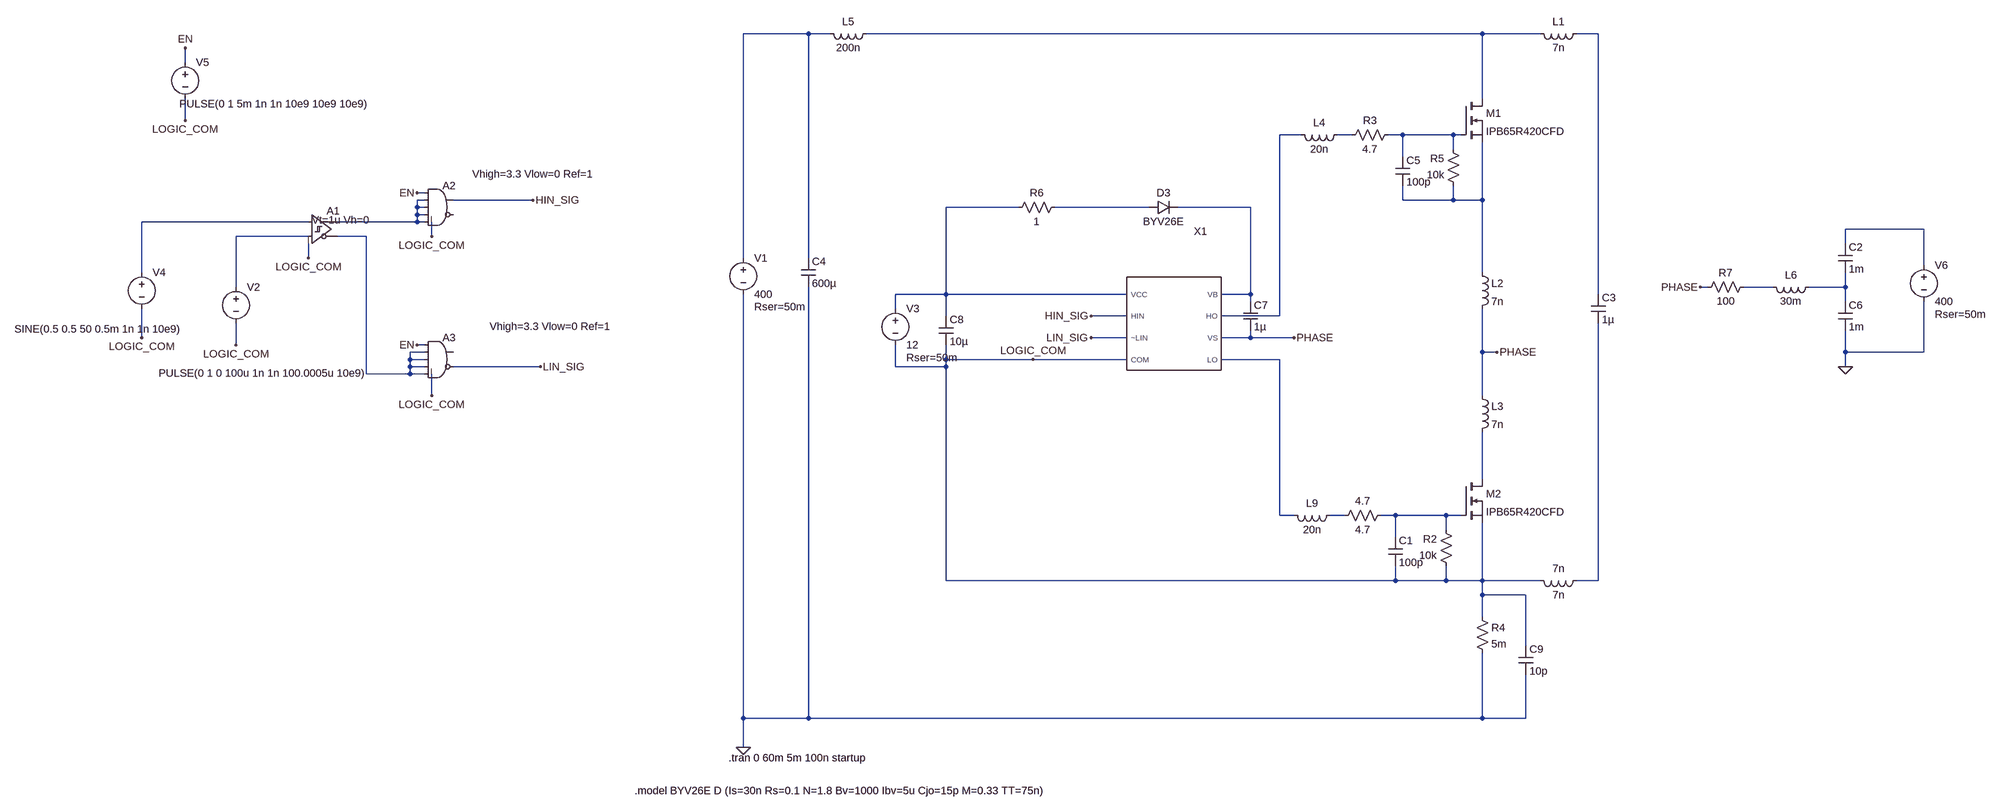
[diagram p0: schematic leg_inverter0.asc]
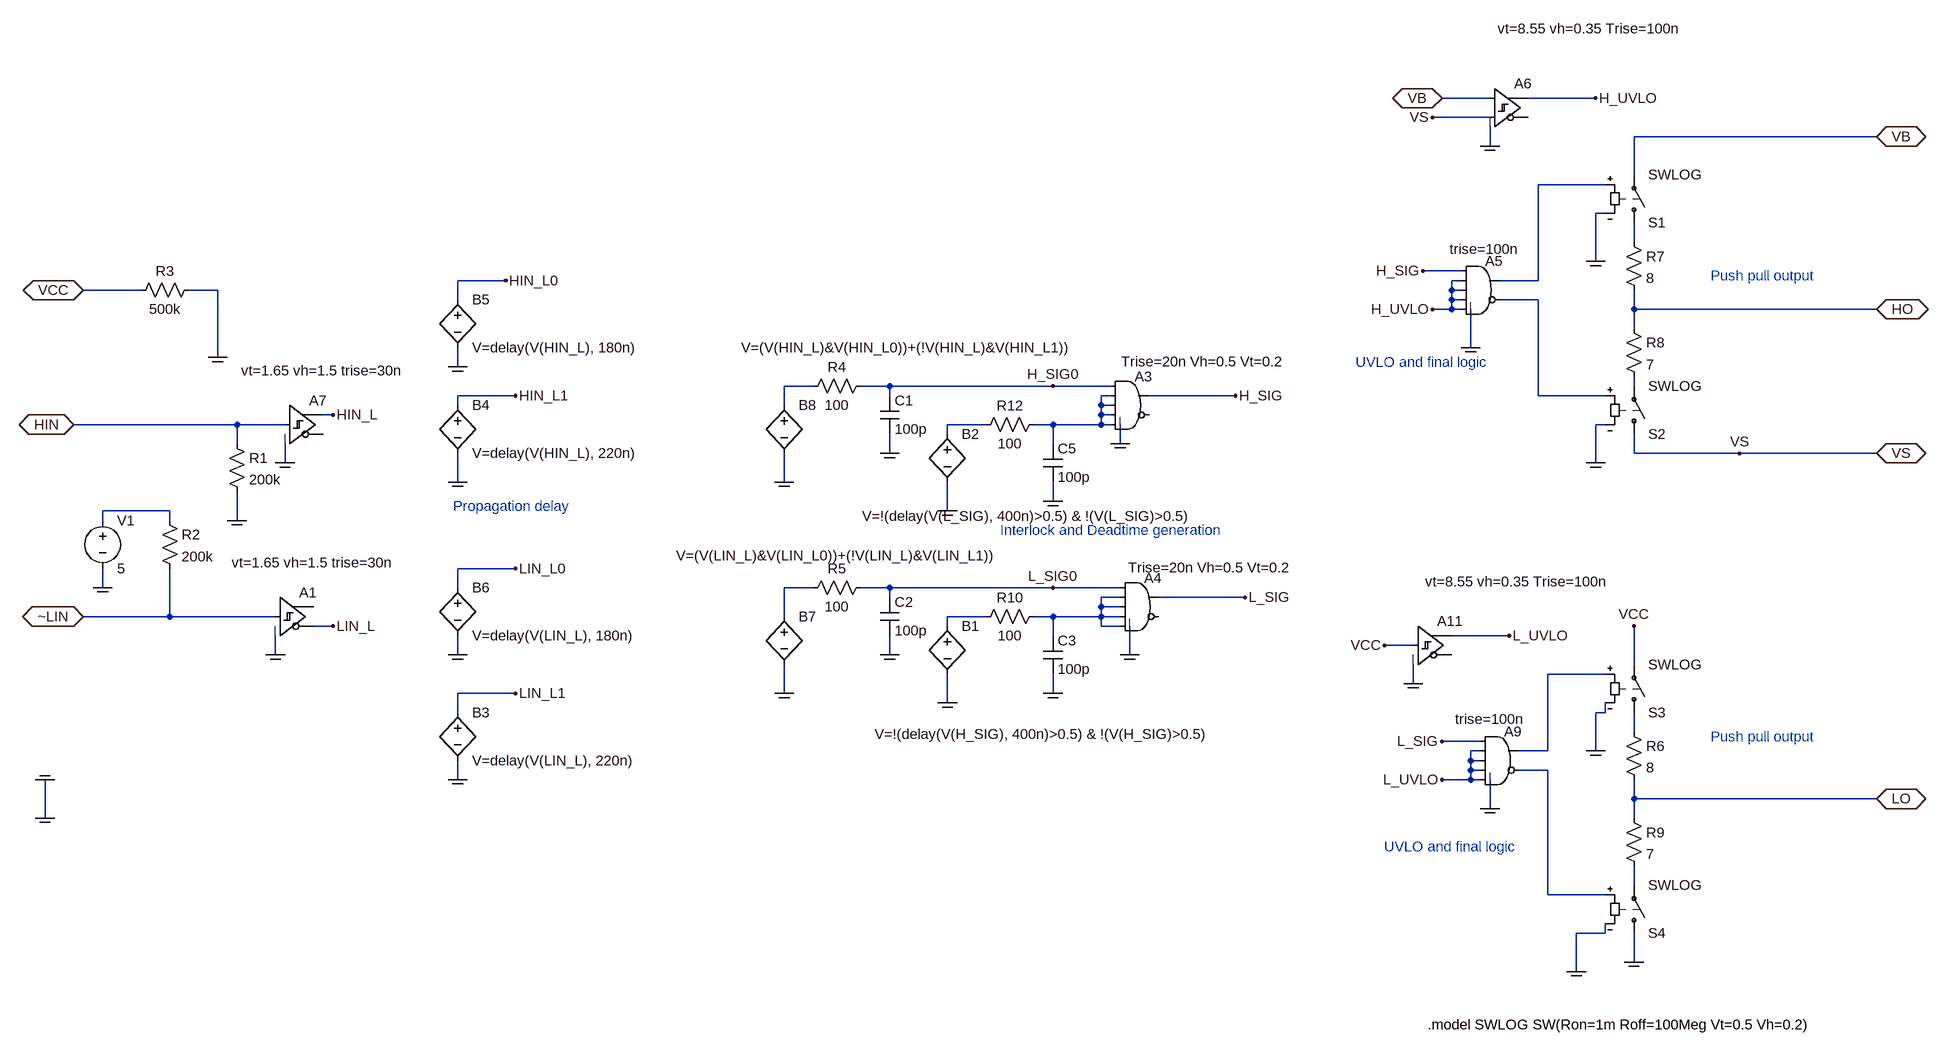
[diagram p1: sub-circuit ir2183_behavioral.asc]
leg_inverter0.asc, the LTspice schematic file:
Version 4.1
SHEET 1 1704 1644
WIRE -1152 -432 -1296 -432
WIRE -1104 -432 -1152 -432
WIRE 336 -432 -1024 -432
WIRE 464 -432 336 -432
WIRE 592 -432 544 -432
WIRE -2528 -368 -2528 -400
WIRE 336 -288 336 -432
WIRE -2528 -240 -2528 -288
WIRE -64 -208 -112 -208
WIRE 48 -208 16 -208
WIRE 160 -208 128 -208
WIRE 272 -208 160 -208
WIRE 288 -208 272 -208
WIRE 272 -176 272 -208
WIRE 160 -160 160 -208
WIRE -2000 -80 -2016 -80
WIRE -2000 -64 -2016 -64
WIRE -1760 -64 -1936 -64
WIRE 160 -64 160 -96
WIRE 272 -64 272 -96
WIRE 272 -64 160 -64
WIRE 336 -64 336 -192
WIRE 336 -64 272 -64
WIRE -2016 -48 -2016 -64
WIRE -2000 -48 -2016 -48
WIRE -688 -48 -848 -48
WIRE -400 -48 -608 -48
WIRE -176 -48 -336 -48
WIRE -2016 -32 -2016 -48
WIRE -2000 -32 -2016 -32
WIRE -2256 -16 -2624 -16
WIRE -2016 -16 -2016 -32
WIRE -2016 -16 -2192 -16
WIRE -2000 -16 -2016 -16
WIRE 1424 0 1184 0
WIRE -2256 16 -2416 16
WIRE -2128 16 -2192 16
WIRE -1984 16 -1984 -16
WIRE 1184 32 1184 0
WIRE -2256 64 -2256 32
WIRE -1296 64 -1296 -432
WIRE -1152 64 -1152 -432
WIRE 1424 80 1424 0
WIRE -2624 96 -2624 -16
WIRE 336 96 336 -64
WIRE -2416 128 -2416 16
WIRE 880 128 864 128
WIRE 1024 128 960 128
WIRE 1184 128 1184 96
WIRE 1184 128 1104 128
WIRE -848 144 -848 -48
WIRE -848 144 -960 144
WIRE -448 144 -848 144
WIRE -176 144 -176 -48
WIRE -176 144 -240 144
WIRE 592 144 592 -432
WIRE -176 160 -176 144
WIRE 1184 160 1184 128
WIRE -960 176 -960 144
WIRE -848 192 -848 144
WIRE -448 192 -528 192
WIRE -112 192 -112 -208
WIRE -112 192 -240 192
WIRE -2624 240 -2624 176
WIRE -448 240 -528 240
WIRE -176 240 -176 224
WIRE -176 240 -240 240
WIRE -80 240 -176 240
WIRE -2416 256 -2416 208
WIRE -2000 256 -2016 256
WIRE -2000 272 -2032 272
WIRE 336 272 336 176
WIRE 368 272 336 272
WIRE 1184 272 1184 224
WIRE 1424 272 1424 160
WIRE 1424 272 1184 272
WIRE -2032 288 -2032 272
WIRE -2000 288 -2032 288
WIRE -848 288 -848 256
WIRE -656 288 -848 288
WIRE -448 288 -656 288
WIRE -112 288 -240 288
WIRE -2032 304 -2032 288
WIRE -2000 304 -2032 304
WIRE -1744 304 -1936 304
WIRE -960 304 -960 256
WIRE -848 304 -848 288
WIRE -848 304 -960 304
WIRE 1184 304 1184 272
WIRE -2128 320 -2128 16
WIRE -2032 320 -2032 304
WIRE -2032 320 -2128 320
WIRE -2000 320 -2032 320
WIRE -1984 368 -1984 320
WIRE 336 368 336 272
WIRE 336 576 336 448
WIRE -112 656 -112 288
WIRE -80 656 -112 656
WIRE 32 656 0 656
WIRE 144 656 112 656
WIRE 256 656 144 656
WIRE 288 656 256 656
WIRE 256 688 256 656
WIRE 144 704 144 656
WIRE -848 800 -848 304
WIRE 144 800 144 768
WIRE 144 800 -848 800
WIRE 256 800 256 768
WIRE 256 800 144 800
WIRE 336 800 336 672
WIRE 336 800 256 800
WIRE 464 800 336 800
WIRE 592 800 592 208
WIRE 592 800 544 800
WIRE 336 832 336 800
WIRE 432 832 336 832
WIRE 336 880 336 832
WIRE 432 944 432 832
WIRE -1296 1104 -1296 144
WIRE -1152 1104 -1152 128
WIRE -1152 1104 -1296 1104
WIRE 336 1104 336 960
WIRE 336 1104 -1152 1104
WIRE 432 1104 432 1008
WIRE 432 1104 336 1104
WIRE -1296 1168 -1296 1104
FLAG 368 272 PHASE
FLAG -1296 1168 0
FLAG -80 240 PHASE
FLAG 1184 304 0
FLAG 864 128 PHASE
FLAG -1760 -64 HIN_SIG
FLAG -528 192 HIN_SIG
FLAG -1744 304 LIN_SIG
FLAG -2528 -400 EN
FLAG -2016 -80 EN
FLAG -2016 256 EN
FLAG -528 240 LIN_SIG
FLAG -656 288 LOGIC_COM
FLAG -1984 368 LOGIC_COM
FLAG -1984 16 LOGIC_COM
FLAG -2256 64 LOGIC_COM
FLAG -2416 256 LOGIC_COM
FLAG -2624 240 LOGIC_COM
FLAG -2528 -240 LOGIC_COM
SYMBOL res 128 640 R90
WINDOW 0 0 56 VBottom 2
WINDOW 3 32 56 VTop 2
SYMATTR InstName 4.7
SYMATTR Value 4.7
SYMBOL res 272 784 R180
WINDOW 0 36 76 Left 2
WINDOW 3 36 40 Left 2
SYMATTR InstName R2
SYMATTR Value 10k
SYMBOL cap 128 704 R0
SYMATTR InstName C1
SYMATTR Value 100p
SYMBOL cap -1168 64 R0
SYMATTR InstName C4
SYMATTR Value 600µ
SYMATTR SpiceLine Rser=1 Lser=20n
SYMBOL ind 560 -448 R90
WINDOW 0 5 56 VBottom 2
WINDOW 3 32 56 VTop 2
SYMATTR InstName L1
SYMATTR Value 7n
SYMBOL ind 560 784 R90
WINDOW 0 5 56 VBottom 2
WINDOW 3 32 56 VTop 2
SYMATTR InstName 7n
SYMATTR Value 7n
SYMBOL ind -1008 -448 R90
WINDOW 0 5 56 VBottom 2
WINDOW 3 32 56 VTop 2
SYMATTR InstName L5
SYMATTR Value 200n
SYMBOL voltage -1296 48 R0
WINDOW 123 0 0 Left 0
WINDOW 39 24 124 Left 2
SYMATTR SpiceLine Rser=50m
SYMATTR InstName V1
SYMATTR Value 400
SYMBOL diode -400 -32 R270
WINDOW 0 32 32 VTop 2
WINDOW 3 0 32 VBottom 2
SYMATTR InstName D3
SYMATTR Value BYV26E
SYMBOL cap -192 160 R0
SYMATTR InstName C7
SYMATTR Value 1µ
SYMBOL cap -864 192 R0
SYMATTR InstName C8
SYMATTR Value 10µ
SYMBOL voltage -960 160 R0
WINDOW 123 0 0 Left 0
WINDOW 39 24 124 Left 2
SYMATTR SpiceLine Rser=50m
SYMATTR InstName V3
SYMATTR Value 12
SYMBOL nmos 288 576 R0
SYMATTR InstName M2
SYMATTR Value IPB65R420CFD
SYMBOL IR2183_Behavioral -288 192 R0
SYMATTR InstName X1
SYMBOL nmos 288 -288 R0
SYMATTR InstName M1
SYMATTR Value IPB65R420CFD
SYMBOL res 144 -224 R90
WINDOW 0 0 56 VBottom 2
WINDOW 3 32 56 VTop 2
SYMATTR InstName R3
SYMATTR Value 4.7
SYMBOL res 288 -80 R180
WINDOW 0 36 76 Left 2
WINDOW 3 36 40 Left 2
SYMATTR InstName R5
SYMATTR Value 10k
SYMBOL cap 144 -160 R0
SYMATTR InstName C5
SYMATTR Value 100p
SYMBOL res -704 -32 R270
WINDOW 0 32 56 VTop 2
WINDOW 3 0 56 VBottom 2
SYMATTR InstName R6
SYMATTR Value 1
SYMBOL ind 320 80 R0
SYMATTR InstName L2
SYMATTR Value 7n
SYMBOL ind 320 352 R0
SYMATTR InstName L3
SYMATTR Value 7n
SYMBOL res 976 112 R90
WINDOW 0 0 56 VBottom 2
WINDOW 3 32 56 VTop 2
SYMATTR InstName R7
SYMATTR Value 100
SYMBOL ind 1120 112 R90
WINDOW 0 5 56 VBottom 2
WINDOW 3 32 56 VTop 2
SYMATTR InstName L6
SYMATTR Value 30m
SYMBOL ind 32 -224 R90
WINDOW 0 5 56 VBottom 2
WINDOW 3 32 56 VTop 2
SYMATTR InstName L4
SYMATTR Value 20n
SYMBOL ind 16 640 R90
WINDOW 0 5 56 VBottom 2
WINDOW 3 32 56 VTop 2
SYMATTR InstName L9
SYMATTR Value 20n
SYMBOL cap 576 144 R0
SYMATTR InstName C3
SYMATTR Value 1µ
SYMATTR SpiceLine Rser=10m Lser=7n
SYMBOL voltage -2416 112 R0
WINDOW 123 0 0 Left 0
WINDOW 39 0 0 Left 0
WINDOW 3 -171 206 Left 2
SYMATTR Value PULSE(0 1 0 100u 1n 1n 100.0005u 10e9)
SYMATTR InstName V2
SYMBOL voltage -2624 80 R0
WINDOW 123 0 0 Left 0
WINDOW 39 0 0 Left 0
WINDOW 3 -281 141 Left 2
SYMATTR Value SINE(0.5 0.5 50 0.5m 1n 1n 10e9)
SYMATTR InstName V4
SYMBOL Digital\\diffschmitt -2256 -64 R0
WINDOW 39 8 44 Left 2
SYMATTR SpiceLine Vt=1u Vh=0
SYMATTR InstName A1
SYMBOL Digital\\and -1968 -112 R0
WINDOW 39 74 -10 Left 2
SYMATTR SpiceLine Vhigh=3.3 Vlow=0 Ref=1
SYMATTR InstName A2
SYMBOL voltage -2528 -384 R0
WINDOW 123 0 0 Left 0
WINDOW 39 0 0 Left 0
WINDOW 3 -13 107 Left 2
SYMATTR Value PULSE(0 1 5m 1n 1n 10e9 10e9 10e9)
SYMATTR InstName V5
SYMBOL Digital\\and -1968 224 R0
WINDOW 39 112 -9 Left 2
SYMATTR SpiceLine Vhigh=3.3 Vlow=0 Ref=1
SYMATTR InstName A3
SYMBOL voltage 1424 64 R0
WINDOW 123 0 0 Left 0
WINDOW 39 24 124 Left 2
SYMATTR SpiceLine Rser=50m
SYMATTR InstName V6
SYMATTR Value 400
SYMBOL cap 1168 32 R0
SYMATTR InstName C2
SYMATTR Value 1m
SYMATTR SpiceLine V=650 Irms=1000 Rser=10m Lser=10n
SYMBOL cap 1168 160 R0
SYMATTR InstName C6
SYMATTR Value 1m
SYMATTR SpiceLine V=650 Irms=1000 Rser=10m Lser=10n
SYMBOL res 320 864 R0
SYMATTR InstName R4
SYMATTR Value 5m
SYMBOL cap 416 944 R0
SYMATTR InstName C9
SYMATTR Value 10p
TEXT -1328 1192 Left 2 !.tran 0 60m 5m 100n startup
TEXT -1536 1264 Left 2 !.model BYV26E D (Is=30n Rs=0.1 N=1.8 Bv=1000 Ibv=5u Cjo=15p M=0.33 TT=75n)

ir2183_behavioral.asc, the sub-circuit schematic file:
Version 4.1
SHEET 1 1824 1396
WIRE 432 -336 352 -336
WIRE 608 -336 496 -336
WIRE 432 -304 336 -304
WIRE 1168 -272 672 -272
WIRE 432 -256 432 -288
WIRE 672 -208 672 -272
WIRE 624 -192 512 -192
WIRE 624 -144 608 -144
WIRE 672 -96 672 -128
WIRE 608 -64 608 -144
WIRE 384 -48 320 -48
WIRE -1280 -32 -1360 -32
WIRE 384 -32 368 -32
WIRE 512 -32 512 -192
WIRE 512 -32 448 -32
WIRE -1888 -16 -1984 -16
WIRE -1760 -16 -1808 -16
WIRE 368 -16 368 -32
WIRE 384 -16 368 -16
WIRE -1360 0 -1360 -32
WIRE 368 0 368 -16
WIRE 384 0 368 0
WIRE 512 0 448 0
WIRE 368 16 368 0
WIRE 368 16 336 16
WIRE 384 16 368 16
WIRE 672 16 672 -16
WIRE 1168 16 672 16
WIRE 672 48 672 16
WIRE 400 80 400 16
WIRE -1760 96 -1760 -16
WIRE -1360 112 -1360 80
WIRE -768 144 -816 144
WIRE -640 144 -688 144
WIRE -368 144 -640 144
WIRE -272 144 -368 144
WIRE 672 144 672 128
WIRE -1264 160 -1360 160
WIRE -640 160 -640 144
WIRE -272 160 -288 160
WIRE -64 160 -208 160
WIRE 512 160 512 0
WIRE 624 160 512 160
WIRE -1360 176 -1360 160
WIRE -816 176 -816 144
WIRE -288 176 -288 160
WIRE -272 176 -288 176
WIRE -1568 192 -1584 192
WIRE -288 192 -288 176
WIRE -272 192 -288 192
WIRE -1728 208 -2000 208
WIRE -1648 208 -1728 208
WIRE -480 208 -544 208
WIRE -368 208 -400 208
WIRE -288 208 -288 192
WIRE -288 208 -368 208
WIRE -272 208 -288 208
WIRE 624 208 608 208
WIRE -544 224 -544 208
WIRE -1728 240 -1728 208
WIRE -368 240 -368 208
WIRE -256 240 -256 208
WIRE -640 256 -640 224
WIRE 672 256 672 224
WIRE 848 256 672 256
WIRE 1168 256 848 256
WIRE -1648 272 -1648 240
WIRE 608 272 608 208
WIRE -1360 304 -1360 256
WIRE -816 304 -816 256
WIRE -368 336 -368 304
WIRE -1840 352 -1952 352
WIRE -544 352 -544 304
WIRE -1952 368 -1952 352
WIRE -1840 368 -1840 352
WIRE -1728 368 -1728 320
WIRE -1264 448 -1360 448
WIRE -1952 480 -1952 448
WIRE -1360 480 -1360 448
WIRE -768 480 -816 480
WIRE -640 480 -688 480
WIRE -368 480 -640 480
WIRE -256 480 -368 480
WIRE -640 496 -640 480
WIRE -256 496 -288 496
WIRE -48 496 -192 496
WIRE -288 512 -288 496
WIRE -256 512 -288 512
WIRE -1840 528 -1840 448
WIRE -1840 528 -1984 528
WIRE -1664 528 -1840 528
WIRE -816 528 -816 480
WIRE -480 528 -544 528
WIRE -368 528 -400 528
WIRE -288 528 -288 512
WIRE -288 528 -368 528
WIRE -256 528 -288 528
WIRE -1568 544 -1600 544
WIRE -544 544 -544 528
WIRE -288 544 -288 528
WIRE -256 544 -288 544
WIRE -368 560 -368 528
WIRE 464 560 368 560
WIRE 304 576 256 576
WIRE -1664 592 -1664 560
WIRE -1360 592 -1360 560
WIRE -640 592 -640 560
WIRE -240 592 -240 544
WIRE 672 608 672 544
WIRE 624 624 528 624
WIRE 304 640 304 608
WIRE -1264 656 -1360 656
WIRE -816 656 -816 608
WIRE -368 656 -368 624
WIRE -544 672 -544 624
WIRE -1360 688 -1360 656
WIRE 624 688 624 672
WIRE 624 688 608 688
WIRE 672 720 672 688
WIRE 416 736 352 736
WIRE 416 752 400 752
WIRE 528 752 528 624
WIRE 528 752 480 752
WIRE 608 752 608 688
WIRE 400 768 400 752
WIRE 416 768 400 768
WIRE 400 784 400 768
WIRE 416 784 400 784
WIRE 528 784 480 784
WIRE -1360 800 -1360 768
WIRE 400 800 400 784
WIRE 400 800 352 800
WIRE 416 800 400 800
WIRE 672 832 672 800
WIRE 1168 832 672 832
WIRE 432 848 432 800
WIRE -2048 864 -2048 800
WIRE 672 864 672 832
WIRE 672 976 672 944
WIRE 528 992 528 784
WIRE 624 992 528 992
WIRE 624 1056 624 1040
WIRE 624 1056 576 1056
WIRE 672 1104 672 1056
WIRE 576 1120 576 1056
FLAG -2000 208 HIN
IOPIN -2000 208 BiDir
FLAG -1984 528 ~LIN
IOPIN -1984 528 BiDir
FLAG -2048 800 COM
IOPIN -2048 800 BiDir
FLAG -1984 -16 VCC
IOPIN -1984 -16 BiDir
FLAG 1168 16 HO
IOPIN 1168 16 BiDir
FLAG 1168 256 VS
IOPIN 1168 256 BiDir
FLAG 1168 -272 VB
IOPIN 1168 -272 BiDir
FLAG -2048 864 COM
FLAG -1728 368 COM
FLAG -48 496 L_SIG
FLAG -64 160 H_SIG
FLAG 1168 832 LO
IOPIN 1168 832 BiDir
FLAG 672 1104 COM
FLAG 672 544 VCC
FLAG 352 -336 VB
IOPIN 352 -336 BiDir
FLAG 432 -256 COM
FLAG 304 640 COM
FLAG 256 576 VCC
FLAG 464 560 L_UVLO
FLAG 608 -336 H_UVLO
FLAG 320 -48 H_SIG
FLAG 336 16 H_UVLO
FLAG 352 800 L_UVLO
FLAG 352 736 L_SIG
FLAG -240 592 COM
FLAG 432 848 COM
FLAG 400 80 COM
FLAG -256 240 COM
FLAG -1760 96 COM
FLAG 576 1120 COM
FLAG 608 752 COM
FLAG -544 672 COM
FLAG -544 352 COM
FLAG -1360 800 COM
FLAG -1360 304 COM
FLAG -1952 480 COM
FLAG 608 -64 COM
FLAG 608 272 COM
FLAG 336 -304 VS
FLAG 848 256 VS
FLAG -1648 272 COM
FLAG -1664 592 COM
FLAG -1568 192 HIN_L
FLAG -1568 544 LIN_L
FLAG -1360 112 COM
FLAG -1360 592 COM
FLAG -1280 -32 HIN_L0
FLAG -1264 160 HIN_L1
FLAG -1264 448 LIN_L0
FLAG -1264 656 LIN_L1
FLAG -816 656 COM
FLAG -816 304 COM
FLAG -368 144 H_SIG0
FLAG -368 480 L_SIG0
FLAG -368 656 COM
FLAG -640 592 COM
FLAG -640 256 COM
FLAG -368 336 COM
SYMBOL res -1744 224 R0
SYMATTR InstName R1
SYMATTR Value 200k
SYMBOL res -1792 -32 R90
WINDOW 0 0 56 VBottom 2
WINDOW 3 32 56 VTop 2
SYMATTR InstName R3
SYMATTR Value 500k
SYMBOL Digital\\and -240 112 R0
WINDOW 39 -14 -9 Left 2
SYMATTR SpiceLine Trise=20n Vh=0.5 Vt=0.2
SYMATTR InstName A3
SYMBOL Digital\\and -224 448 R0
WINDOW 39 -19 -1 Left 2
SYMATTR SpiceLine Trise=20n Vh=0.5 Vt=0.2
SYMATTR InstName A4
SYMBOL sw 672 -112 M180
SYMATTR InstName S1
SYMATTR Value SWLOG
SYMBOL sw 672 240 M180
SYMATTR InstName S2
SYMATTR Value SWLOG
SYMBOL res 656 -112 R0
SYMATTR InstName R7
SYMATTR Value 8
SYMBOL res 656 32 R0
SYMATTR InstName R8
SYMATTR Value 7
SYMBOL sw 672 704 M180
SYMATTR InstName S3
SYMATTR Value SWLOG
SYMBOL sw 672 1072 M180
SYMATTR InstName S4
SYMATTR Value SWLOG
SYMBOL res 656 704 R0
SYMATTR InstName R6
SYMATTR Value 8
SYMBOL res 656 848 R0
SYMATTR InstName R9
SYMATTR Value 7
SYMBOL Digital\\and 416 -80 R0
WINDOW 39 -51 -4 Left 2
SYMATTR SpiceLine trise=100n
SYMATTR InstName A5
SYMBOL Digital\\and 448 704 R0
WINDOW 39 -74 -5 Left 2
SYMATTR SpiceLine trise=100n
SYMATTR InstName A9
SYMBOL bv -544 528 R0
WINDOW 3 -121 196 Left 2
SYMATTR Value V=!(delay(V(H_SIG), 400n)>0.5) & !(V(H_SIG)>0.5)
SYMATTR InstName B1
SYMBOL bv -544 208 R0
WINDOW 3 -142 153 Left 2
SYMATTR Value V=!(delay(V(L_SIG), 400n)>0.5) & !(V(L_SIG)>0.5)
SYMATTR InstName B2
SYMBOL bv -1360 672 R0
SYMATTR InstName B3
SYMATTR Value V=delay(V(LIN_L), 220n)
SYMBOL bv -1360 160 R0
SYMATTR InstName B4
SYMATTR Value V=delay(V(HIN_L), 220n)
SYMBOL res -1856 352 R0
SYMATTR InstName R2
SYMATTR Value 200k
SYMBOL voltage -1952 352 R0
WINDOW 123 0 0 Left 0
WINDOW 39 0 0 Left 0
SYMATTR InstName V1
SYMATTR Value 5
SYMBOL Digital\\schmitt 304 512 R0
WINDOW 39 20 -42 Left 2
SYMATTR SpiceLine vt=8.55 vh=0.35 Trise=100n
SYMATTR InstName A11
SYMBOL Digital\\diffschmitt 432 -384 R0
WINDOW 39 13 -68 Left 2
SYMATTR SpiceLine vt=8.55 vh=0.35 Trise=100n
SYMATTR InstName A6
SYMBOL Digital\\schmitt -1648 144 R0
WINDOW 39 -73 -26 Left 2
SYMATTR SpiceLine vt=1.65 vh=1.5 trise=30n
SYMATTR InstName A7
SYMBOL Digital\\schmitt -1664 464 R0
WINDOW 39 -73 -26 Left 2
SYMATTR SpiceLine vt=1.65 vh=1.5 trise=30n
SYMATTR InstName A1
SYMBOL bv -1360 -16 R0
SYMATTR InstName B5
SYMATTR Value V=delay(V(HIN_L), 180n)
SYMBOL bv -1360 464 R0
SYMATTR InstName B6
SYMATTR Value V=delay(V(LIN_L), 180n)
SYMBOL bv -816 512 R0
WINDOW 3 -180 -85 Left 2
SYMATTR Value V=(V(LIN_L)&V(LIN_L0))+(!V(LIN_L)&V(LIN_L1))
SYMATTR InstName B7
SYMBOL bv -816 160 R0
WINDOW 3 -72 -80 Left 2
SYMATTR Value V=(V(HIN_L)&V(HIN_L0))+(!V(HIN_L)&V(HIN_L1))
SYMATTR InstName B8
SYMBOL res -672 128 R90
WINDOW 0 0 56 VBottom 2
WINDOW 3 32 56 VTop 2
SYMATTR InstName R4
SYMATTR Value 100
SYMBOL cap -656 160 R0
SYMATTR InstName C1
SYMATTR Value 100p
SYMBOL res -672 464 R90
WINDOW 0 0 56 VBottom 2
WINDOW 3 32 56 VTop 2
SYMATTR InstName R5
SYMATTR Value 100
SYMBOL cap -656 496 R0
SYMATTR InstName C2
SYMATTR Value 100p
SYMBOL res -384 512 R90
WINDOW 0 0 56 VBottom 2
WINDOW 3 32 56 VTop 2
SYMATTR InstName R10
SYMATTR Value 100
SYMBOL cap -384 560 R0
SYMATTR InstName C3
SYMATTR Value 100p
SYMBOL res -384 192 R90
WINDOW 0 0 56 VBottom 2
WINDOW 3 32 56 VTop 2
SYMATTR InstName R12
SYMATTR Value 100
SYMBOL cap -384 240 R0
SYMATTR InstName C5
SYMATTR Value 100p
TEXT 328 1208 Left 2 !.model SWLOG SW(Ron=1m Roff=100Meg Vt=0.5 Vh=0.2)
TEXT -1368 344 Left 2 ;Propagation delay
TEXT -456 384 Left 2 ;Interlock and Deadtime generation
TEXT 208 104 Left 2 ;UVLO and final logic
TEXT 256 912 Left 2 ;UVLO and final logic
TEXT 800 728 Left 2 ;Push pull output
TEXT 800 -40 Left 2 ;Push pull output

The netlist it stands for:
* leg_inverter0.asc
R§4.7 N021 N020 4.7
R2 LOGIC_COM N021 10k
C1 N021 LOGIC_COM 100p
C4 N001 0 600µ Rser=1 Lser=20n
L1 N003 N002 7n
L§7n N022 LOGIC_COM 7n
L5 N002 N001 200n
V1 N001 0 400 Rser=50m
D3 N010 N011 BYV26E
C7 N011 PHASE 1µ
C8 N009 LOGIC_COM 10µ
V3 N009 LOGIC_COM 12 Rser=50m
M2 N019 N021 LOGIC_COM LOGIC_COM IPB65R420CFD
X§X1 LOGIC_COM HIN_SIG N004 N018 N011 N009 PHASE LIN_SIG ir2183_behavioral
M1 N002 N006 N008 N008 IPB65R420CFD
R3 N006 N005 4.7
R5 N008 N006 10k
C5 N006 N008 100p
R6 N009 N010 1
L2 N008 PHASE 7n
L3 PHASE N019 7n
R7 N016 PHASE 100
L6 N017 N016 30m
L4 N005 N004 20n
L9 N020 N018 20n
C3 N003 N022 1µ Rser=10m Lser=7n
V2 N014 LOGIC_COM PULSE(0 1 0 100u 1n 1n 100.0005u 10e9)
V4 N012 LOGIC_COM SINE(0.5 0.5 50 0.5m 1n 1n 10e9)
A1 N012 N014 LOGIC_COM LOGIC_COM LOGIC_COM N015 N007 LOGIC_COM SCHMITT Vt=1u Vh=0
A2 EN N007 N007 N007 N007 LOGIC_COM HIN_SIG LOGIC_COM AND Vhigh=3.3 Vlow=0 Ref=1
V5 EN LOGIC_COM PULSE(0 1 5m 1n 1n 10e9 10e9 10e9)
A3 EN N015 N015 N015 N015 LIN_SIG LOGIC_COM LOGIC_COM AND Vhigh=3.3 Vlow=0 Ref=1
V6 N013 0 400 Rser=50m
C2 N013 N017 1m V=650 Irms=1000 Rser=10m Lser=10n
C6 N017 0 1m V=650 Irms=1000 Rser=10m Lser=10n
R4 LOGIC_COM 0 5m
C9 LOGIC_COM 0 10p

* block symbol definitions
.subckt ir2183_behavioral COM HIN HO LO VB VCC VS ~LIN
R1 HIN COM 200k
R3 COM VCC 500k
A3 H_SIG0 N006 N006 N006 N006 COM H_SIG COM AND Trise=20n Vh=0.5 Vt=0.2
A4 L_SIG0 N010 N010 N010 N010 COM L_SIG COM AND Trise=20n Vh=0.5 Vt=0.2
S1 N002 VB N001 COM SWLOG
S2 VS N005 N003 COM SWLOG
R7 N002 HO 8
R8 HO N005 7
S3 N013 VCC N012 COM SWLOG
S4 COM N015 N014 COM SWLOG
R6 N013 LO 8
R9 LO N015 7
A5 H_SIG H_UVLO H_UVLO H_UVLO H_UVLO N003 N001 COM AND trise=100n
A9 L_SIG L_UVLO L_UVLO L_UVLO L_UVLO N014 N012 COM AND trise=100n
B1 N011 COM V=!(delay(V(H_SIG), 400n)>0.5) & !(V(H_SIG)>0.5)
B2 N007 COM V=!(delay(V(L_SIG), 400n)>0.5) & !(V(L_SIG)>0.5)
B3 LIN_L1 COM V=delay(V(LIN_L), 220n)
B4 HIN_L1 COM V=delay(V(HIN_L), 220n)
R2 N008 ~LIN 200k
V1 N008 COM 5
A11 VCC COM COM COM COM COM L_UVLO COM SCHMITT vt=8.55 vh=0.35 Trise=100n
A6 VB VS COM COM COM COM H_UVLO COM SCHMITT vt=8.55 vh=0.35 Trise=100n
A7 HIN COM COM COM COM COM HIN_L COM SCHMITT vt=1.65 vh=1.5 trise=30n
A1 ~LIN COM COM COM COM LIN_L COM COM SCHMITT vt=1.65 vh=1.5 trise=30n
B5 HIN_L0 COM V=delay(V(HIN_L), 180n)
B6 LIN_L0 COM V=delay(V(LIN_L), 180n)
B7 N009 COM V=(V(LIN_L)&V(LIN_L0))+(!V(LIN_L)&V(LIN_L1))
B8 N004 COM V=(V(HIN_L)&V(HIN_L0))+(!V(HIN_L)&V(HIN_L1))
R4 H_SIG0 N004 100
C1 H_SIG0 COM 100p
R5 L_SIG0 N009 100
C2 L_SIG0 COM 100p
R10 N010 N011 100
C3 N010 COM 100p
R12 N006 N007 100
C5 N006 COM 100p
.model SWLOG SW(Ron=1m Roff=100Meg Vt=0.5 Vh=0.2)
* Propagation delay
* Interlock and Deadtime generation
* UVLO and final logic
* UVLO and final logic
* Push pull output
* Push pull output
.ends ir2183_behavioral

.model D D
.lib standard.dio
.model NMOS NMOS
.model PMOS PMOS
.lib standard.mos
.tran 0 60m 5m 100n startup
.model BYV26E D (Is=30n Rs=0.1 N=1.8 Bv=1000 Ibv=5u Cjo=15p M=0.33 TT=75n)
.backanno
.end